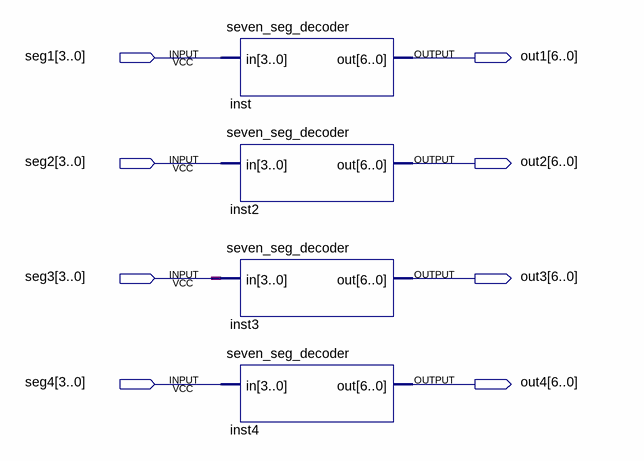
[diagram p0: schematic sheet]
// Quartus schematic lab5blocks.bdf as structural Verilog: 4 symbols, 8 pins
module lab5blocks (
  input  [3:0] seg1,
  input  [3:0] seg2,
  input  [3:0] seg3,
  input  [3:0] seg4,
  output [6:0] out1,
  output [6:0] out2,
  output [6:0] out3,
  output [6:0] out4
);

  seven_seg_decoder inst (.in(seg1), .out(out1));
  seven_seg_decoder inst2 (.in(seg2), .out(out2));
  seven_seg_decoder inst3 (.in(seg3), .out(out3));
  seven_seg_decoder inst4 (.in(seg4), .out(out4));
endmodule
